# Altium schematic sheet HeatingAC_Garage.SchDoc: HVAC & Garage Control
size B; Date: 7/11/2012; CheckedBy: Dell Hanks; Author: Levi Balling; CompanyName: Smart House; DrawnBy: Levi Balling; Engineer: Levi Balling; Organization: U of U Computer Engineering; Address1: 50 S Central Campus Dr.; Address2: Rm. 3280 MEB; Address3: SLC, UT 84112; DocumentNumber: 1; Revision: 4; SheetNumber: 6; SheetTotal: 13; VersionControl_RevNumber: 1; Project: Smart Home; Website: www.eng.utah.edu/~lballing/SmartHome; DocumentName: HVAC & Garage Control; ModifiedDate: 7/11/2012; ProjectName: Smart Home
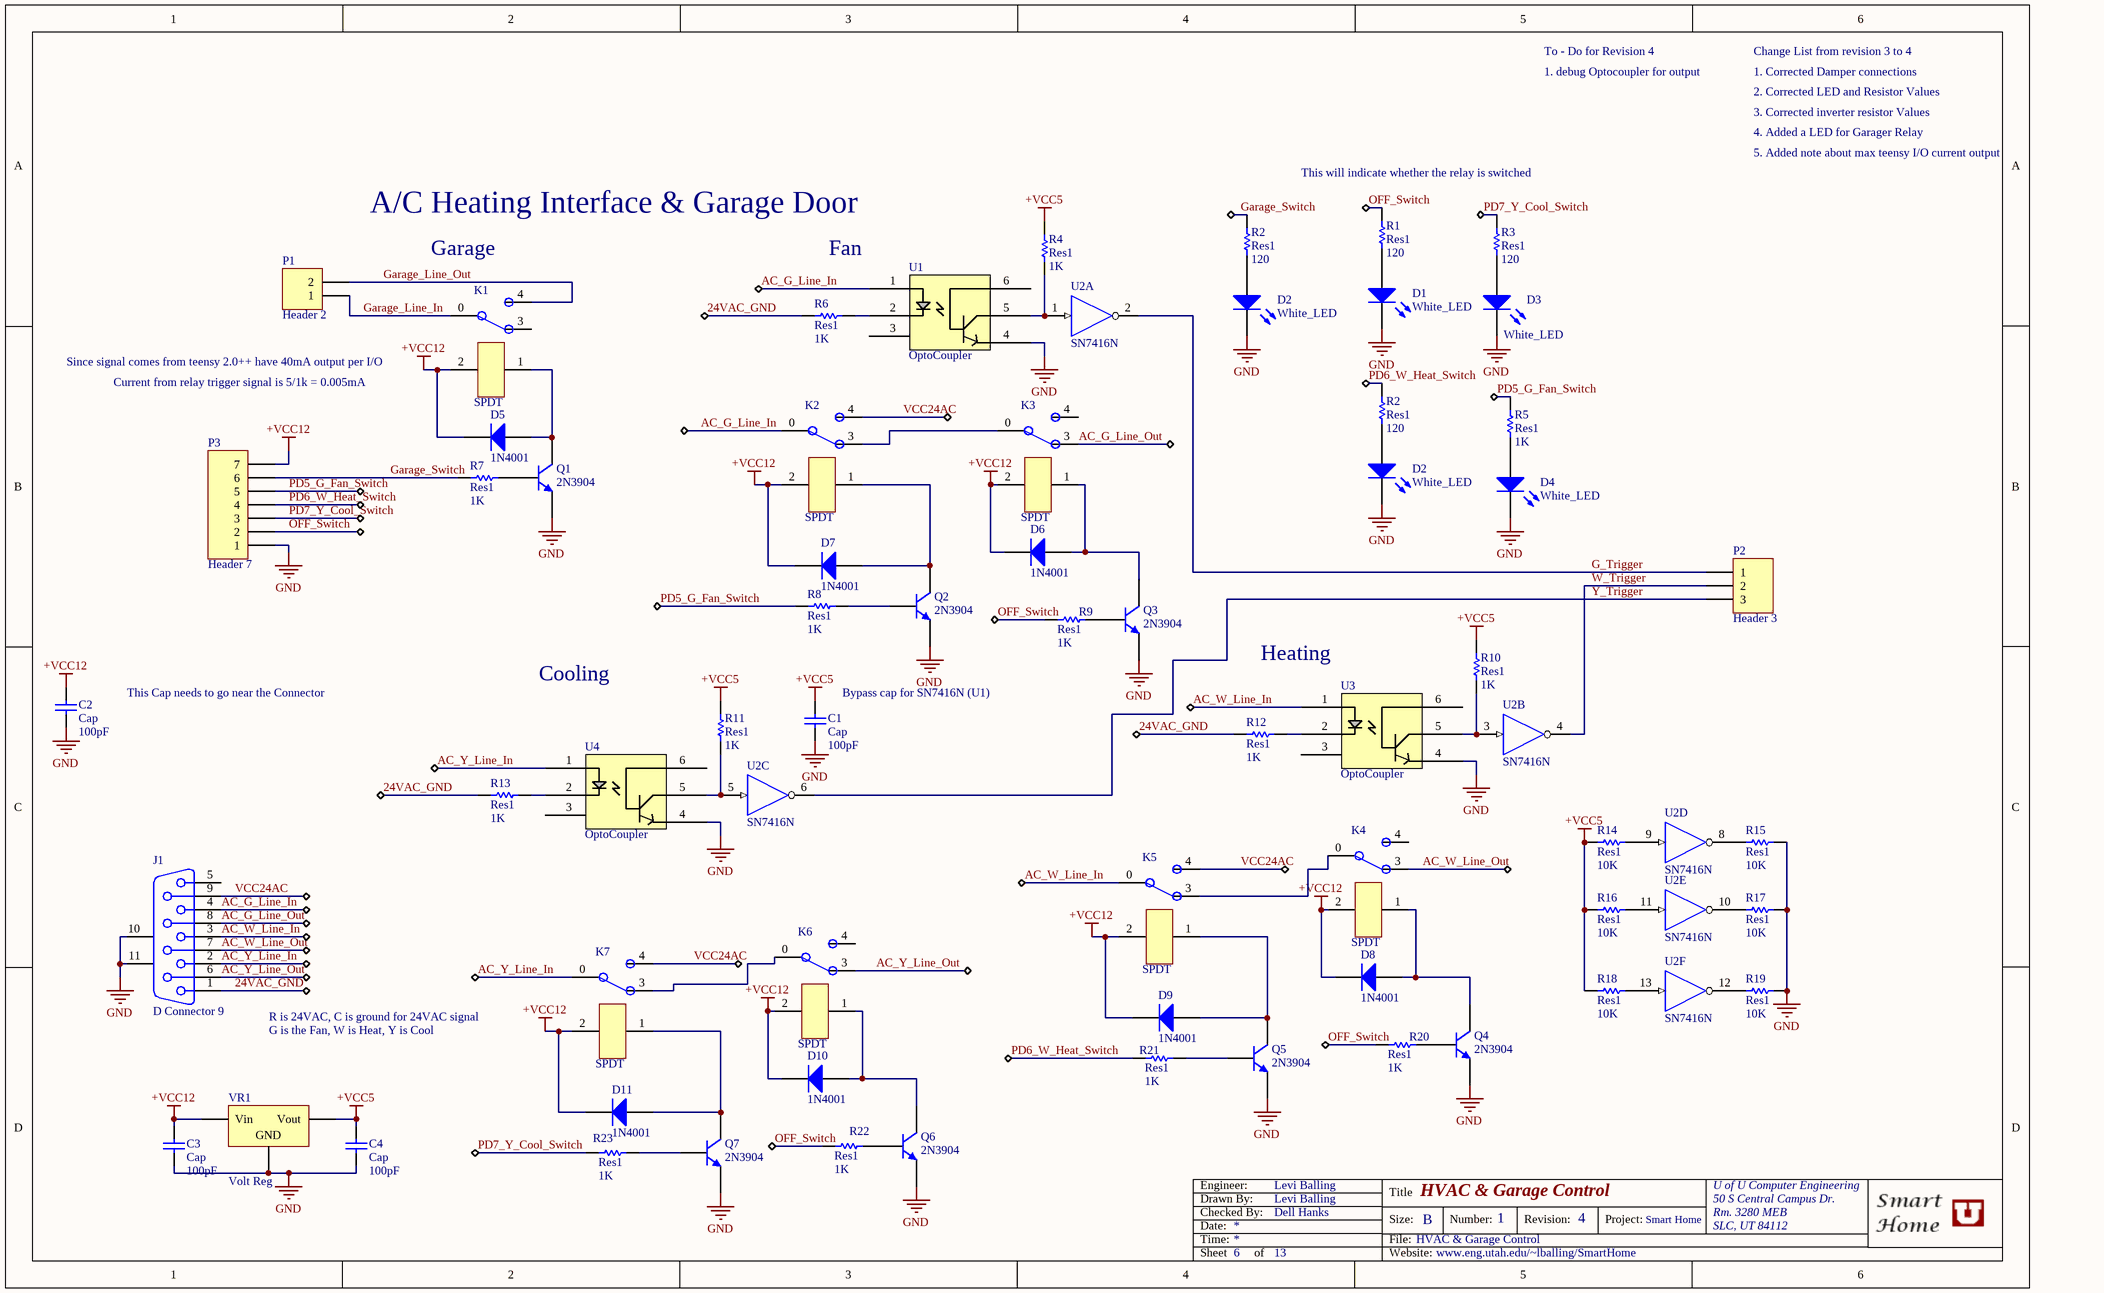
[diagram p0: HeatingAC_Garage.SchDoc]

## Parts
(Parts that share a designator on the sheet are numbered #1, #2 ... from top to bottom, then left to right.)
C1  Cap  value 100pF  [RAD-0.3]
C2  Cap  value 100pF  [RAD-0.3]
C3  Cap  value 100pF  [RAD-0.3]
C4  Cap  value 100pF  [RAD-0.3]
D1  White_LED  [LED-0]
D2#1  White_LED  [LED-0]
D2#2  White_LED  [LED-0]
D3  White_LED  [LED-0]
D4  White_LED  [LED-0]
D5  1N4001  [DO-41]
D6  1N4001  [DO-41]
D7  1N4001  [DO-41]
D8  1N4001  [DO-41]
D9  1N4001  [DO-41]
D10  1N4001  [DO-41]
D11  1N4001  [DO-41]
J1  D Connector 9  [DSUB1.385-2H9]
K1  SPDT  [Relay  SPDT]
K2  SPDT  [Relay  SPDT]
K3  SPDT  [Relay  SPDT]
K4  SPDT  [Relay  SPDT]
K5  SPDT  [Relay  SPDT]
K6  SPDT  [Relay  SPDT]
K7  SPDT  [Relay  SPDT]
P1  Header 2  [HDR1X2]
P2  Header 3  [HDR1X3]
P3  Header 7  [HDR1X7]
Q1  2N3904  [TO-92A]
Q2  2N3904  [TO-92A]
Q3  2N3904  [TO-92A]
Q4  2N3904  [TO-92A]
Q5  2N3904  [TO-92A]
Q6  2N3904  [TO-92A]
Q7  2N3904  [TO-92A]
R1  Res1  value 120  [AXIAL-0.3]
R2#1  Res1  value 120  [AXIAL-0.3]
R2#2  Res1  value 120  [AXIAL-0.3]
R3  Res1  value 120  [AXIAL-0.3]
R4  Res1  value 1K  [AXIAL-0.3]
R5  Res1  value 1K  [AXIAL-0.3]
R6  Res1  value 1K  [AXIAL-0.3]
R7  Res1  value 1K  [AXIAL-0.3]
R8  Res1  value 1K  [AXIAL-0.3]
R9  Res1  value 1K  [AXIAL-0.3]
R10  Res1  value 1K  [AXIAL-0.3]
R11  Res1  value 1K  [AXIAL-0.3]
R12  Res1  value 1K  [AXIAL-0.3]
R13  Res1  value 1K  [AXIAL-0.3]
R14  Res1  value 10K  [AXIAL-0.3]
R15  Res1  value 10K  [AXIAL-0.3]
R16  Res1  value 10K  [AXIAL-0.3]
R17  Res1  value 10K  [AXIAL-0.3]
R18  Res1  value 10K  [AXIAL-0.3]
R19  Res1  value 10K  [AXIAL-0.3]
R20  Res1  value 1K  [AXIAL-0.3]
R21  Res1  value 1K  [AXIAL-0.3]
R22  Res1  value 1K  [AXIAL-0.3]
R23  Res1  value 1K  [AXIAL-0.3]
U1  OptoCoupler  [DIP4]
U2  SN7416N  [N014]  (parts A,B,C,D,E,F of 6)
U3  OptoCoupler  [DIP4]
U4  OptoCoupler  [DIP4]
VR1  Volt Reg  [D2PAK_N]

## Nets
+VCC5: C1.2 C4.2 R4.2 R10.2 R11.2 R14.1 R16.1 R18.1 VR1.3(Vout)
+VCC12: C2.2 C3.2 D5.2(K) D6.2(K) D7.2(K) D8.2(K) D9.2(K) D10.2(K) D11.2(K) K1.2 K2.2 K3.2 K4.2 K5.2 K6.2 K7.2 P3.7 VR1.1(Vin)
GND: C1.1 C2.1 C3.1 C4.1 D1.2(K) D2#1.2(K) D2#2.2(K) D3.2(K) D4.2(K) J1.10(MH1) J1.11(MH2) P3.1 Q1.1(E) Q2.1(E) Q3.1(E) Q4.1(E) Q5.1(E) Q6.1(E) Q7.1(E) R15.2 R17.2 R19.2 U1.4(Emitter) U2.7(GND) U3.4(Emitter) U4.4(Emitter) VR1.2(GND)
VCC: U2.14(VCC)
24VAC_GND: J1.1 R6.1 R12.1 R13.1
AC_G_Line_In: J1.4 K2.0 U1.1(Anode)
AC_G_Line_Out: J1.8 K3.3
AC_W_Line_In: J1.3 K5.0 U3.1(Anode)
AC_W_Line_Out: J1.7 K4.3
AC_Y_Line_In: J1.2 K7.0 U4.1(Anode)
AC_Y_Line_Out: J1.6 K6.3
G_Trigger: P2.1 U2.2(Y)
Garage_Line_In: K1.0 P1.1
Garage_Line_Out: K1.4 P1.2
Garage_Switch: P3.6 R2#1.1 R7.1
OFF_Switch: P3.2 R1.1 R9.1 R20.1 R22.1
PD5_G_Fan_Switch: P3.5 R5.1 R8.1
PD6_W_Heat_Switch: P3.4 R2#2.1 R21.1
PD7_Y_Cool_Switch: P3.3 R3.1 R23.1
VCC24AC: J1.9 K2.4 K5.4 K7.4
W_Trigger: P2.2 U2.4(Y)
Y_Trigger: P2.3 U2.6(Y)
NetD1_1: D1.1(A) R1.2
NetD2#1_1: D2#1.1(A) R2#1.2
NetD2#2_1: D2#2.1(A) R2#2.2
NetD3_1: D3.1(A) R3.2
NetD4_1: D4.1(A) R5.2
NetD5_1: D5.1(A) K1.1 Q1.3(C)
NetD6_1: D6.1(A) K3.1 Q3.3(C)
NetD7_1: D7.1(A) K2.1 Q2.3(C)
NetD8_1: D8.1(A) K4.1 Q4.3(C)
NetD9_1: D9.1(A) K5.1 Q5.3(C)
NetD10_1: D10.1(A) K6.1 Q6.3(C)
NetD11_1: D11.1(A) K7.1 Q7.3(C)
NetK2_3: K2.3 K3.0
NetK4_0: K4.0 K5.3
NetK6_0: K6.0 K7.3
NetQ1_2: Q1.2(B) R7.2
NetQ2_2: Q2.2(B) R8.2
NetQ3_2: Q3.2(B) R9.2
NetQ4_2: Q4.2(B) R20.2
NetQ5_2: Q5.2(B) R21.2
NetQ6_2: Q6.2(B) R22.2
NetQ7_2: Q7.2(B) R23.2
NetR4_1: R4.1 U1.5(Collector) U2.1(A)
NetR6_2: R6.2 U1.2(Cathode)
NetR10_1: R10.1 U2.3(A) U3.5(Collector)
NetR11_1: R11.1 U2.5(A) U4.5(Collector)
NetR12_2: R12.2 U3.2(Cathode)
NetR13_2: R13.2 U4.2(Cathode)
NetR14_2: R14.2 U2.9(A)
NetR15_1: R15.1 U2.8(Y)
NetR16_2: R16.2 U2.11(A)
NetR17_1: R17.1 U2.10(Y)
NetR18_2: R18.2 U2.13(A)
NetR19_1: R19.1 U2.12(Y)

Not connected (* = marked no-connect by the designer): J1 5; K1 3; K3 4; K4 4; K6 4; U1 3 6(Base); U3 3 6(Base); U4 3 6(Base)

## Notes on the sheet
- To - Do for Revision 4
- 1. debug Optocoupler for output
- Change List from revision 3 to 4
- 1. Corrected Damper connections
- 2. Corrected LED and Resistor Values
- 3. Corrected inverter resistor Values
- 4. Added a LED for Garager Relay
- 5. Added note about max teensy I/O current output
- A/C Heating Interface & Garage Door
- This will indicate whether the relay is switched
- (near K1) Garage
- Fan
- Since signal comes from teensy 2.0++ have 40mA output per I/O
- Current from relay trigger signal is 5/1k = 0.005mA
- This Cap needs to go near the Connector
- Cooling
- (near C1) Bypass cap for SN7416N (U1)
- (near U3) Heating
- R is 24VAC, C is ground for 24VAC signal
- G is the Fan, W is Heat, Y is Cool
- Date:
- Time:
- Engineer:
- Drawn By:
- Checked By:
- Title
- Size:
- File:
- B
- Number:
- Revision:
- Project:
- Sheet
- of
- Website:

## Library data of the parts
C1-C4 = Cap: Capacitor; Published: 8-Jun-2000; LatestRevisionDate: 17-Jul-2002; LatestRevisionNote: Re-released for DXP Platform.; PackageReference: RAD-0.3; Publisher: Altium Limited; PackageDescription: Radial Cap, Thru-Hole; 2 Leads; 0.3 in Pin Spacing
D1 D2#1 D2#2 D3 D4 = LED0: Typical INFRARED GaAs LED; Published: 8-Jun-2000; LatestRevisionDate: 08-Jul-2005; LatestRevisionNote: Mech Layer 1 removed.; PackageReference: LED-0; Publisher: Altium Limited; PackageDescription: LED; 2 Leads
D5-D11 = 1N4001: 1.0 Ampere General Purpose Rectifier; Published: 8-Jun-2000; LatestRevisionDate: 17-Jul-2002; LatestRevisionNote: Re-released for DXP Platform.; DatasheetDocument: 1998; PackageDocument: Aug-1999; PackageReference: DO-41; Publisher: Altium Limited; Code_JEDEC: DO-204-AL; ComponentLink1Description: Manufacturer Link; ComponentLink1URL: http://www.fairchildsemi.com/; ComponentLink2Description: Pinout Specification; ComponentLink2URL: http://www.fairchildsemi.com/ds/1N%2F1N4001.pdf
J1 = D Connector 9: Receptacle Assembly, 9 Position, Right Angle; PackageDocument: O; Positions: 9; Published: 15-Jun-2001; LatestRevisionDate: 17-Jul-2002; LatestRevisionNote: Re-released for DXP Platform.; DatasheetDocument: 1-Sep-1999; PackageReference: 788750; Publisher: Altium Limited; Orientation: Right Angle; Gender: Receptacle
K1-K7 = SPDT: Vendor: Taydaelectronics; Coil Resistance: 400; Price: 0.64
P1 = Header 2: Header, 2-Pin; LatestRevisionDate: 17-Jul-2002; LatestRevisionNote: Re-released for DXP Platform.; Publisher: Altium Limited
P2 = Header 3: Header, 3-Pin; LatestRevisionDate: 17-Jul-2002; LatestRevisionNote: Re-released for DXP Platform.; Publisher: Altium Limited
P3 = Header 7: Header, 7-Pin; LatestRevisionDate: 17-Jul-2002; LatestRevisionNote: Re-released for DXP Platform.; Publisher: Altium Limited
Q1-Q7 = 2N3904: NPN General Purpose Amplifier; Published: 8-Jun-2000; LatestRevisionDate: 15-Jan-2003; LatestRevisionNote: PCB Footprint 'BCY-W3/D4.7' replaced; DatasheetVersion: 1997; PackageVersion: Sep-1998; PackageReference: TO-92A; Publisher: Altium Limited; PackageDescription: TO, Flat Index; 3 In-Line, Axial Leads; Body Dia. 4.5mm; Leads 0.51 x 0.48 mm (max); ComponentLink1URL: http://www.fairchildsemi.com/; ComponentLink2Description: Datasheet; ComponentLink2URL: http://www.fairchildsemi.com/ds/2N%2F2N3904.pdf; ComponentLink1Description: Manufacturer Link
R1 R2#1 R2#2 R3-R23 = Res1: Resistor; Published: 8-Jun-2000; LatestRevisionDate: 17-Jul-2002; LatestRevisionNote: Re-released for DXP Platform.; PackageReference: AXIAL-0.3; Publisher: Altium Limited; PackageDescription: Axial Device, Thru-Hole; 2 Leads; 0.3 in Pin Spacing
U1 U3 U4 = OptoCoupler: Vendor: Taydaelectronics; Price: 0.3
U2 = SN7416N: Hex Inverter Buffer / Driver with High-Voltage Outputs; Published: 8-Jun-2000; LatestRevisionDate: 04-Mar-2005; LatestRevisionNote: Stylized 3D Model Added.; DatasheetVersion: Mar-1988; PackageVersion: Oct-1995; PackageReference: N014; Publisher: Altium Limited; PackageDescription: DIP; 14 Leads; Row Spacing 7.62 mm; Pitch 2.54 mm; ComponentLink1URL: http://www.ti.com/; ComponentLink2Description: Datasheet; ComponentLink2URL: http://www-s.ti.com/sc/ds/sn5416.pdf; ComponentLink3Description: Packaging Specification; ComponentLink3URL: http://focus.ti.com/lit/ml/mpdi002c/mpdi002c.pdf; ComponentLink1Description: Manufacturer Link
VR1 = Volt Reg: Voltage Regulator; Published: 24-Mar-1999; LatestRevisionDate: 29-May-2009; LatestRevisionNote: IPC-7351 Footprint Added.; PackageReference: D2PAK; Publisher: Altium Limited; PackageDescription: 3-Pin Transistor Outline Package 2.54 mm Pitch, 15.1 mm Lead Span